# Altium schematic sheet PWM_OUTPUT.SchDoc
size A4; SheetNumber: 2; SheetTotal: 9
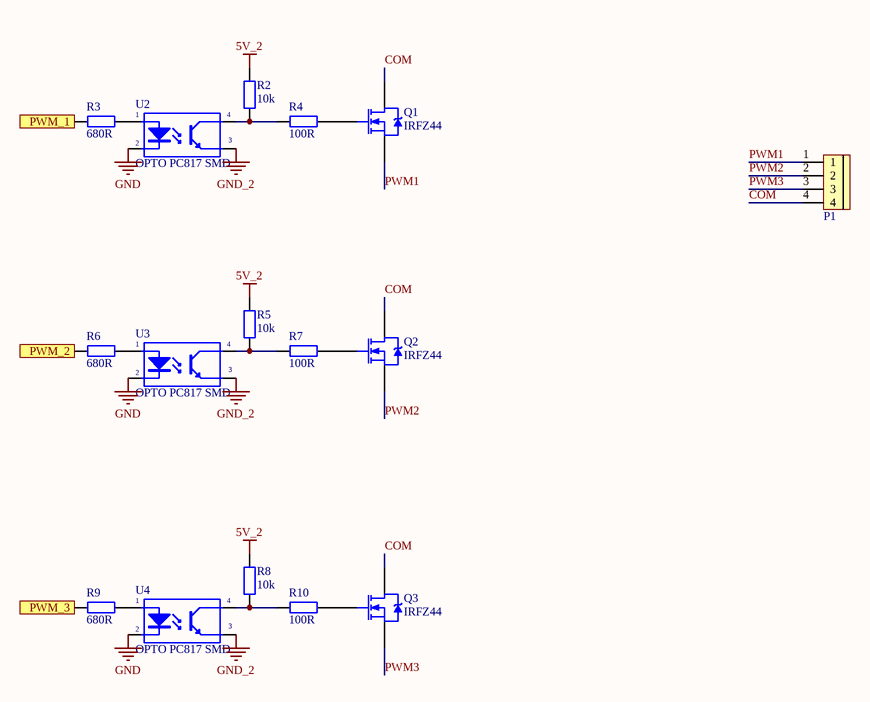
[diagram p0: PWM_OUTPUT.SchDoc]

## Parts
P1  CON 4 EDG5.08  [CON 4 4EDG5.08]  (value not drawn)
Q1  IRFZ44  [TO220]
Q2  IRFZ44  [TO220]
Q3  IRFZ44  [TO220]
R2  10k  [tro smd 0603]
R3  680R  [tro smd 0603]
R4  100R  [tro smd 0603]
R5  10k  [tro smd 0603]
R6  680R  [tro smd 0603]
R7  100R  [tro smd 0603]
R8  10k  [tro smd 0603]
R9  680R  [tro smd 0603]
R10  100R  [tro smd 0603]
U2  OPTO PC817 SMD  [SOP4]
U3  OPTO PC817 SMD  [SOP4]
U4  OPTO PC817 SMD  [SOP4]

## Ports
PWM_1 (in), PWM_2 (in), PWM_3 (in)

## Nets
5V_2: R2.2 R5.2 R8.2
GND: U2.2(K) U3.2(K) U4.2(K)
GND_2: U2.3(E) U3.3(E) U4.3(E)
COM: P1.4 Q1.2(D) Q2.2(D) Q3.2(D)
PWM1: P1.1 Q1.3(S)
PWM2: P1.2 Q2.3(S)
PWM3: P1.3 Q3.3(S)
PWM_1: R3.1 ; port PWM_1
PWM_2: R6.1 ; port PWM_2
PWM_3: R9.1 ; port PWM_3
NetQ1_1: Q1.1(G) R4.2
NetQ2_1: Q2.1(G) R7.2
NetQ3_1: Q3.1(G) R10.2
NetR2_1: R2.1 R4.1 U2.4(C)
NetR3_2: R3.2 U2.1(A)
NetR5_1: R5.1 R7.1 U3.4(C)
NetR6_2: R6.2 U3.1(A)
NetR8_1: R8.1 R10.1 U4.4(C)
NetR9_2: R9.2 U4.1(A)

## Library data of the parts
P1 = CON 4 EDG5.08: Cắm; Ten_Linh_Kien: CON 4 2EDG5.08-4P 5.08MM ( Xanh Cong); Ma_Hang: MH000979; Don_Vi: Con; Ghi_Chu: *; Kieu_Chan: *; Chung_Loai: Cắm
Q1-Q3 = IRFZ44 DIP: N-Channel Power MOSFET
R2 R5 R8 = Tro 0603 5% 10k: Dán; Don_Vi: Con; So_Chan: 2; Ten_Linh_Kien: Trở 0603 5% 10k; Ma_Hang: MH006316; Chung_Loai: Dán; Kieu_Chan: *
R3 R6 R9 = Tro 0603 1% 680R: Dán; Don_Vi: Con; So_Chan: 2; Ten_Linh_Kien: Trở 0603 1% 680R; Ma_Hang: MH006336; Chung_Loai: Dán; Kieu_Chan: *
R4 R7 R10 = Tro 0603 5% 100R: Dán; Don_Vi: Con; So_Chan: 2; Ten_Linh_Kien: Trở 0603 5% 100R; Ma_Hang: MH006315; Chung_Loai: Dán; Kieu_Chan: *
U2-U4 = OPTO PC817 SMD: Single Opto; Value: PC817